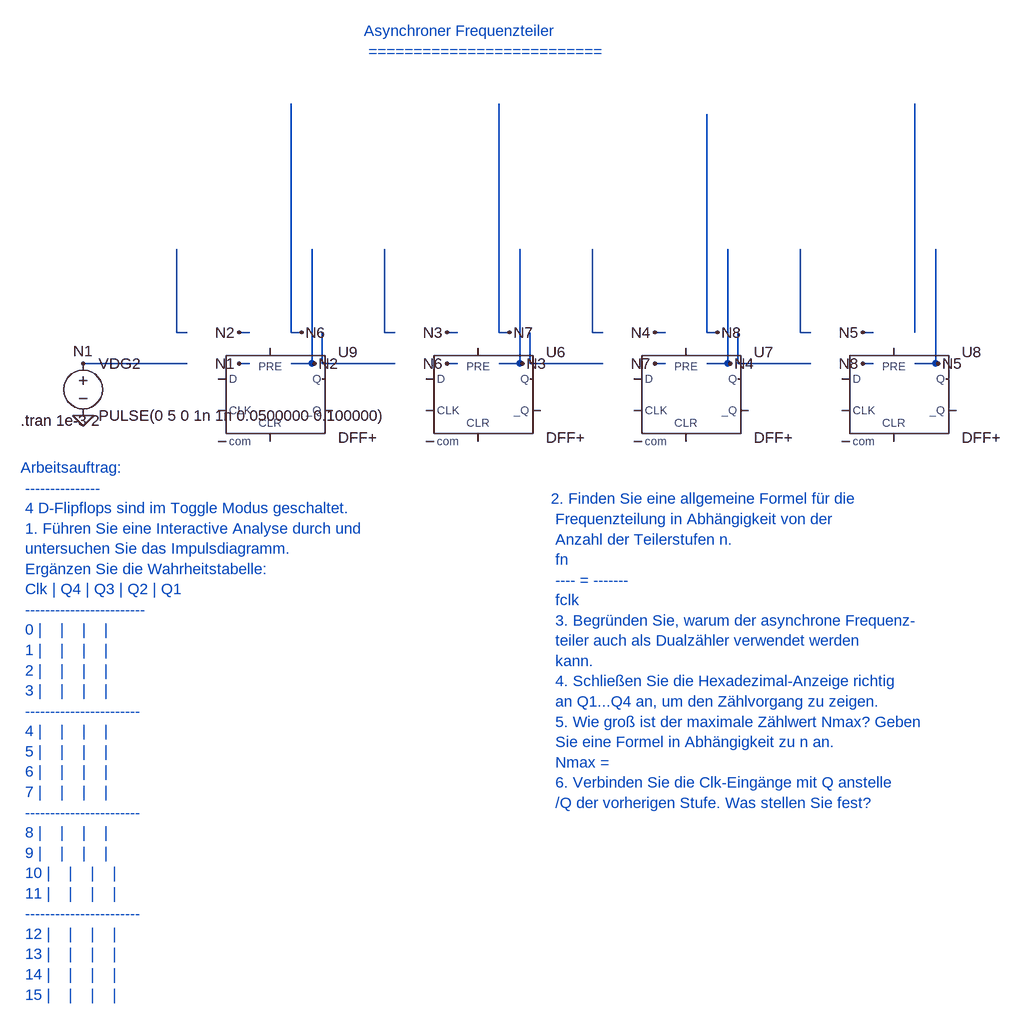
[diagram p0: schematic 6_2_1_Asynchroner_Frequenzteiler.asc]
6_2_1_Asynchroner_Frequenzteiler.asc, the LTspice schematic file:
Version 4
SHEET 1 880 680
WIRE 1440 592 1472 592
WIRE 1472 592 1472 416
WIRE 1264 416 1264 544
WIRE 1264 544 1280 544
WIRE 160 592 320 592
WIRE 480 192 480 544
WIRE 800 192 800 544
WIRE 1440 192 1440 544
WIRE 480 592 512 592
WIRE 512 592 512 416
WIRE 304 416 304 544
WIRE 304 544 320 544
WIRE 800 592 832 592
WIRE 832 592 832 416
WIRE 624 416 624 544
WIRE 624 544 640 544
WIRE 1120 592 1152 592
WIRE 1152 592 1152 416
WIRE 944 416 944 544
WIRE 944 544 960 544
WIRE 1120 208 1120 544
WIRE 1280 592 1168 592
WIRE 1168 592 1168 544
WIRE 960 592 848 592
WIRE 848 592 848 544
WIRE 640 592 528 592
WIRE 528 592 528 544
WIRE 480 592 516 592
WIRE 416 544 400 544
WIRE 800 592 836 592
WIRE 736 544 720 544
WIRE 1120 592 1156 592
WIRE 1056 544 1040 544
WIRE 1440 592 1476 592
WIRE 1376 544 1360 544
WIRE 416 592 400 592
WIRE 480 544 496 544
WIRE 736 592 720 592
WIRE 800 544 816 544
WIRE 1056 592 1040 592
WIRE 1120 544 1136 544
WIRE 1376 592 1360 592
FLAG 160 672 0
FLAG 516 592 N2
FLAG 400 544 N2
FLAG 836 592 N3
FLAG 720 544 N3
FLAG 1156 592 N4
FLAG 1040 544 N4
FLAG 1476 592 N5
FLAG 1360 544 N5
FLAG 160 592 N1
FLAG 400 592 N1
FLAG 496 544 N6
FLAG 720 592 N6
FLAG 816 544 N7
FLAG 1040 592 N7
FLAG 1136 544 N8
FLAG 1360 592 N8
SYMBOL Digital\dflop 768 568 R0
SYMATTR InstName U6
SYMATTR Value DFF+
SYMATTR LibreSpice kind=dff;edge=rising;async=high;vth=2.5;vhigh=5;pins=D,CLK,SET,RESET,Q,~Q
SYMBOL Digital\dflop 1088 568 R0
SYMATTR InstName U7
SYMATTR Value DFF+
SYMATTR LibreSpice kind=dff;edge=rising;async=high;vth=2.5;vhigh=5;pins=D,CLK,SET,RESET,Q,~Q
SYMBOL Digital\dflop 1408 568 R0
SYMATTR InstName U8
SYMATTR Value DFF+
SYMATTR LibreSpice kind=dff;edge=rising;async=high;vth=2.5;vhigh=5;pins=D,CLK,SET,RESET,Q,~Q
SYMBOL voltage 160 576 R0
SYMATTR InstName VDG2
SYMATTR Value PULSE(0 5 0 1n 1n 0.0500000 0.100000)
SYMBOL Digital\dflop 448 568 R0
SYMATTR InstName U9
SYMATTR Value DFF+
SYMATTR LibreSpice kind=dff;edge=rising;async=high;vth=2.5;vhigh=5;pins=D,CLK,SET,RESET,Q,~Q
TEXT 64 680 Left 2 !.tran 1e-3 2
TEXT 64 752 Left 2 ;Arbeitsauftrag: \n --------------- \n 4 D-Flipflops sind im Toggle Modus geschaltet. \n 1. Führen Sie eine Interactive Analyse durch und \n untersuchen Sie das Impulsdiagramm. \n Ergänzen Sie die Wahrheitstabelle: \n Clk | Q4 | Q3 | Q2 | Q1 \n ------------------------ \n 0 |    |    |    | \n 1 |    |    |    | \n 2 |    |    |    | \n 3 |    |    |    | \n ----------------------- \n 4 |    |    |    | \n 5 |    |    |    | \n 6 |    |    |    | \n 7 |    |    |    | \n ----------------------- \n 8 |    |    |    | \n 9 |    |    |    | \n 10 |    |    |    | \n 11 |    |    |    | \n ----------------------- \n 12 |    |    |    | \n 13 |    |    |    | \n 14 |    |    |    | \n 15 |    |    |    |
TEXT 592 80 Left 2 ;Asynchroner Frequenzteiler \n ==========================
TEXT 880 800 Left 2 ;2. Finden Sie eine allgemeine Formel für die \n Frequenzteilung in Abhängigkeit von der \n Anzahl der Teilerstufen n. \n fn \n ---- = ------- \n fclk \n 3. Begründen Sie, warum der asynchrone Frequenz- \n teiler auch als Dualzähler verwendet werden \n kann. \n 4. Schließen Sie die Hexadezimal-Anzeige richtig \n an Q1...Q4 an, um den Zählvorgang zu zeigen. \n 5. Wie groß ist der maximale Zählwert Nmax? Geben \n Sie eine Formel in Abhängigkeit zu n an. \n Nmax = \n 6. Verbinden Sie die Clk-Eingänge mit Q anstelle \n /Q der vorherigen Stufe. Was stellen Sie fest?

The netlist it stands for:
* 6_2_1_Asynchroner_Frequenzteiler.asc
A§U6 0 0 0 0 0 0 0 0 DFLOP DFF+
A§U7 0 0 0 0 0 0 0 0 DFLOP DFF+
A§U8 0 0 0 0 0 0 0 0 DFLOP DFF+
VDG2 N1 0 PULSE(0 5 0 1n 1n 0.0500000 0.100000)
A§U9 0 0 0 0 0 0 0 0 DFLOP DFF+
.tran 1e-3 2
* Arbeitsauftrag:
*  ---------------
*  4 D-Flipflops sind im Toggle Modus geschaltet.
*  1. Führen Sie eine Interactive Analyse durch und
*  untersuchen Sie das Impulsdiagramm.
*  Ergänzen Sie die Wahrheitstabelle:
*  Clk | Q4 | Q3 | Q2 | Q1
*  ------------------------
*  0 |    |    |    |
*  1 |    |    |    |
*  2 |    |    |    |
*  3 |    |    |    |
*  -----------------------
*  4 |    |    |    |
*  5 |    |    |    |
*  6 |    |    |    |
*  7 |    |    |    |
*  -----------------------
*  8 |    |    |    |
*  9 |    |    |    |
*  10 |    |    |    |
*  11 |    |    |    |
*  -----------------------
*  12 |    |    |    |
*  13 |    |    |    |
*  14 |    |    |    |
*  15 |    |    |    |
* Asynchroner Frequenzteiler
*  ==========================
* 2. Finden Sie eine allgemeine Formel für die
*  Frequenzteilung in Abhängigkeit von der
*  Anzahl der Teilerstufen n.
*  fn
*  ---- = -------
*  fclk
*  3. Begründen Sie, warum der asynchrone Frequenz-
*  teiler auch als Dualzähler verwendet werden
*  kann.
*  4. Schließen Sie die Hexadezimal-Anzeige richtig
*  an Q1...Q4 an, um den Zählvorgang zu zeigen.
*  5. Wie groß ist der maximale Zählwert Nmax? Geben
*  Sie eine Formel in Abhängigkeit zu n an.
*  Nmax =
*  6. Verbinden Sie die Clk-Eingänge mit Q anstelle
*  /Q der vorherigen Stufe. Was stellen Sie fest?
.backanno
.end